# Altium project phonev2.PrjPcb
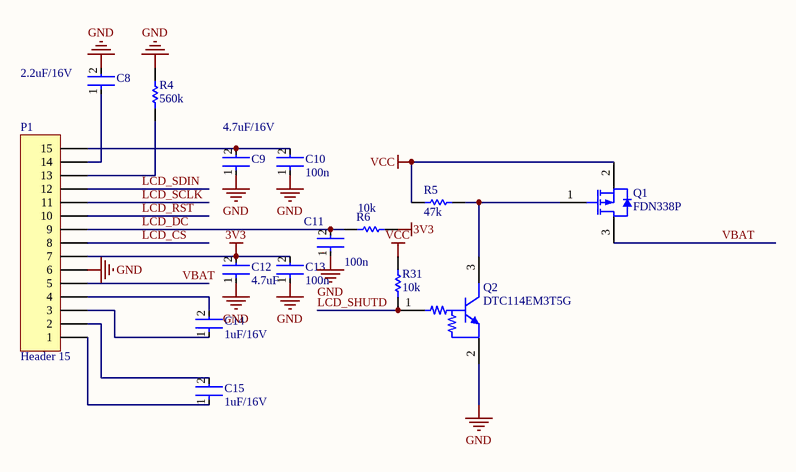
[diagram p0: lcd.SchDoc]
4 sheets, 131 parts. Net scope: global (net labels, ports and power ports of the same name join across sheets).
Board file: PCB.PcbDoc
Sheets:
  lcd.SchDoc
  phone.SchDoc
  keypad.SchDoc
  main.SchDoc

## Sheet lcd.SchDoc
size A

### Parts
C8  2.2uF/16V  [FP-GRM188-0_1-e0_2_0_55-IPC_A]
C9  4.7uF/16V  [FP-GRM188-0_1-e0_2_0_55-IPC_A]
C10  100n  [FP-GRM155-0_05-IPC_A]
C11  100n  [FP-GRM155-0_05-IPC_A]
C12  4.7uF  [FP-GRM188-0_1-e0_2_0_55-IPC_A]
C13  100n  [FP-GRM155-0_05-IPC_A]
C14  1uF/16V  [FP-GRM188-0_1-e0_2_0_55-IPC_A]
C15  1uF/16V  [FP-GRM188-0_1-e0_2_0_55-IPC_A]
P1  Header 15  [FLEX_CONN]
Q1  FDN338P  [FAIR-SSOT3L-3_V]
Q2  DTC114EM3T5G  [ONSC-SOT-723-3-631AA-01_V]
R4  560k  [RESC1005X40X25NL05T10]
R5  47k  [RESC1005X40X25NL05T10]
R6  10k  [RESC1005X40X25NL05T10]
R31  10k  [RESC1005X40X25NL05T10]

### Nets
3V3: C12.2 C13.2 P1.7 R6.1
GND: C8.2 C9.1 C10.1 C11.1 C12.1 C13.1 P1.6 Q2.2(E) R4.2
VCC: Q1.2(SOURCE) R5.1 R31.2
LCD_CS: P1.8
LCD_DC: C11.2 P1.9 R6.2
LCD_RST: P1.10
LCD_SCLK: P1.11
LCD_SDIN: P1.12
LCD_SHUTD: Q2.1(B) R31.1
VBAT: P1.5 Q1.3(DRAIN)
NetC8_1: C8.1 P1.14
NetC9_2: C9.2 C10.2 P1.15
NetC14_1: C14.1 P1.3
NetC14_2: C14.2 P1.4
NetC15_1: C15.1 P1.1
NetC15_2: C15.2 P1.2
NetP1_13: P1.13 R4.1
NetQ1_1: Q1.1(GATE) Q2.3(C) R5.2

### Library data of the parts
C8 C9 C12 C14 C15 = CMP-2006-02792-2: Chip Multilayer Ceramic Capacitors for General Purpose, 0603, 10uF, X5R, 15%, 20%, 6.3V; Packaging: Tape and Reel; Voltage Rating (DC): 6.3V; Width: 0.031inch; Termination: SMD/SMT; Dielectric: X5R; Package Quantity: 4000; Voltage Rating: 6.3V; Capacitance: 10uF; Case/Package: 0603; Min Operating Temperature: -55°C; Voltage: 6.3V; Length: 1.6mm; Thickness: 0.035inch; Lead Free: Lead Free; Depth: 0.8mm; Case Code (Imperial): 0603; Max Operating Temperature: 85°C; Material: Ceramic; Height: 0.8mm; Tolerance: 20%; Mount: Surface Mount; REACH SVHC: No SVHC; Radiation Hardening: No; Case Code (Metric): 1608
C10 C11 C13 = CMP-2008-04369-2: Chip Multilayer Ceramic Capacitors for General Purpose, 0402, 470pF, C0G, 30ppm/°C, 5%, 50V; Insulation Resistance: 10GR; Depth: 0.5mm; Voltage Rating: 50V; Packaging: Tape and Reel; Material: Ceramic; Lead Free: Lead Free; Max Operating Temperature: 125°C; Length: 1mm; Min Operating Temperature: -55°C; Height: 0.5mm; Width: 0.5mm; Thickness: 0.022inch; Voltage: 50V; Termination: SMD/SMT; Dielectric Material: Ceramic; REACH SVHC: No SVHC; Voltage Rating (DC): 50V; Package Quantity: 1; Dielectric: C0G; Radiation Hardening: No; Mount: Surface Mount; Case/Package: 0402; Number of Pins: 2; Tolerance: 5%; Temperature Coefficient: 30ppm/°C; Case Code (Metric): 1005; Capacitance: 470pF; Case Code (Imperial): 0402
P1 = Header 15: Header, 15-Pin; LatestRevisionDate: 17-Jul-2002; LatestRevisionNote: Re-released for DXP Platform.; Publisher: Altium Limited
Q1 = CMP-2000-06251-1: P-Channel Specified Power Trench(R) MOSFET, 2.5 V, -20 V, -1.6 A, -55 to 150 degC, 3-Pin SOT23, RoHS, Tape and Reel; Manufacturer: Fairchild Semiconductor; Current - Continuous Drain (Id) @ 25°C: 1.6A(Ta); Product Training Modules: HighVoltageSwitchesforPowerProcessingSMPSPowerSwitch; Gate Charge (Qg) @ Vgs: 6.2nC@4.5V; Package Version: Rev. 3, 05/2015; PCN Design/Specification: MoldCompound08/April/2008; Vgs(th) (Max) @ Id: 1.5V@250µA; FET Type: MOSFETP-Channel,MetalOxide; FET Feature: Standard; PCN Packaging: BinaryYearCodeMarking15/Jan/2014; Other Names: FDN338PTR; Online Catalog: P-ChannelLogicLevelGateFETs; Input Capacitance (Ciss) @ Vds: 451pF@10V; Rds On (Max) @ Id, Vgs: 115mOhm@1.6A,4.5V; Drain to Source Voltage (Vdss): 20V; Power - Max: 460mW; Datasheet Version: Rev. F1(W), 11/2013; Manufacturer URL: https://www.fairchildsemi.com/; Package Description: 3-Pin Small Outline Transistor, Body 2.92 x 1.4 mm, Pitch 0.95 mm; Datasheet URL: https://datasheet.ciiva.com/22655/1802191-22655335.pdf; Family: FETs-Single; Package URL: https://www.fairchildsemi.com/package-drawings/MA/MA03B.pdf; Package Reference: SSOT3L; Supplier Device Package: 3-SSOT; Standard Package: 3,000; Package / Case: TO-236-3,SC-59,SOT-23-3; Mounting Technology: SurfaceMount; Series: PowerTrench®; Mounting Type: SurfaceMount; Packaging: Tape&Reel(TR); Category: DiscreteSemiconductorProducts
Q2 = CMP-0630-00443-1: Digital Transistor (BRT), R1=10 kOhm, R2=10 kOhm, NPN Transistor, 3-Pin SOT-723, Pb-Free, Tape and Reel; Manufacturer: On Semiconductor; V(BR)CEO Min (V): 50; R1/R2 Typ: 1; IC Continuous (A): 0.1; hFE Min: 35; ComponentLink3Description: Package Specification; Packing: Tape and Reel; ComponentLink1Description: Manufacturer URL; DatasheetVersion: Rev. 5; PackageDescription: 3-Pin Small Outline Transistor, Body 1.2 x 0.8 mm, Pitch 0.4 mm; RoHS: TRUE; Mounting Technology: Surface Mount; ComponentLink2URL: http://www.onsemi.cn/pub_link/Collateral/DTC114E-D.PDF; ComponentLink2Description: Datasheet; ComponentLink1URL: http://www.onsemi.com/; Polarity: NPN; PackageVersion: Rev. D, 08/2009; PartNumber: DTC114EM3T5G; PackageReference: SOT-723-3-631AA-01; ComponentLink3URL: http://www.onsemi.com/pub_link/Collateral/631AA.PDF
R4-R6 R31 = CMP-1011-00001-2: Manufacturer: Yageo / Phycomp; Part Number: RC0402JR-070RL

## Sheet phone.SchDoc
size A4; SheetNumber: 1; SheetTotal: 1
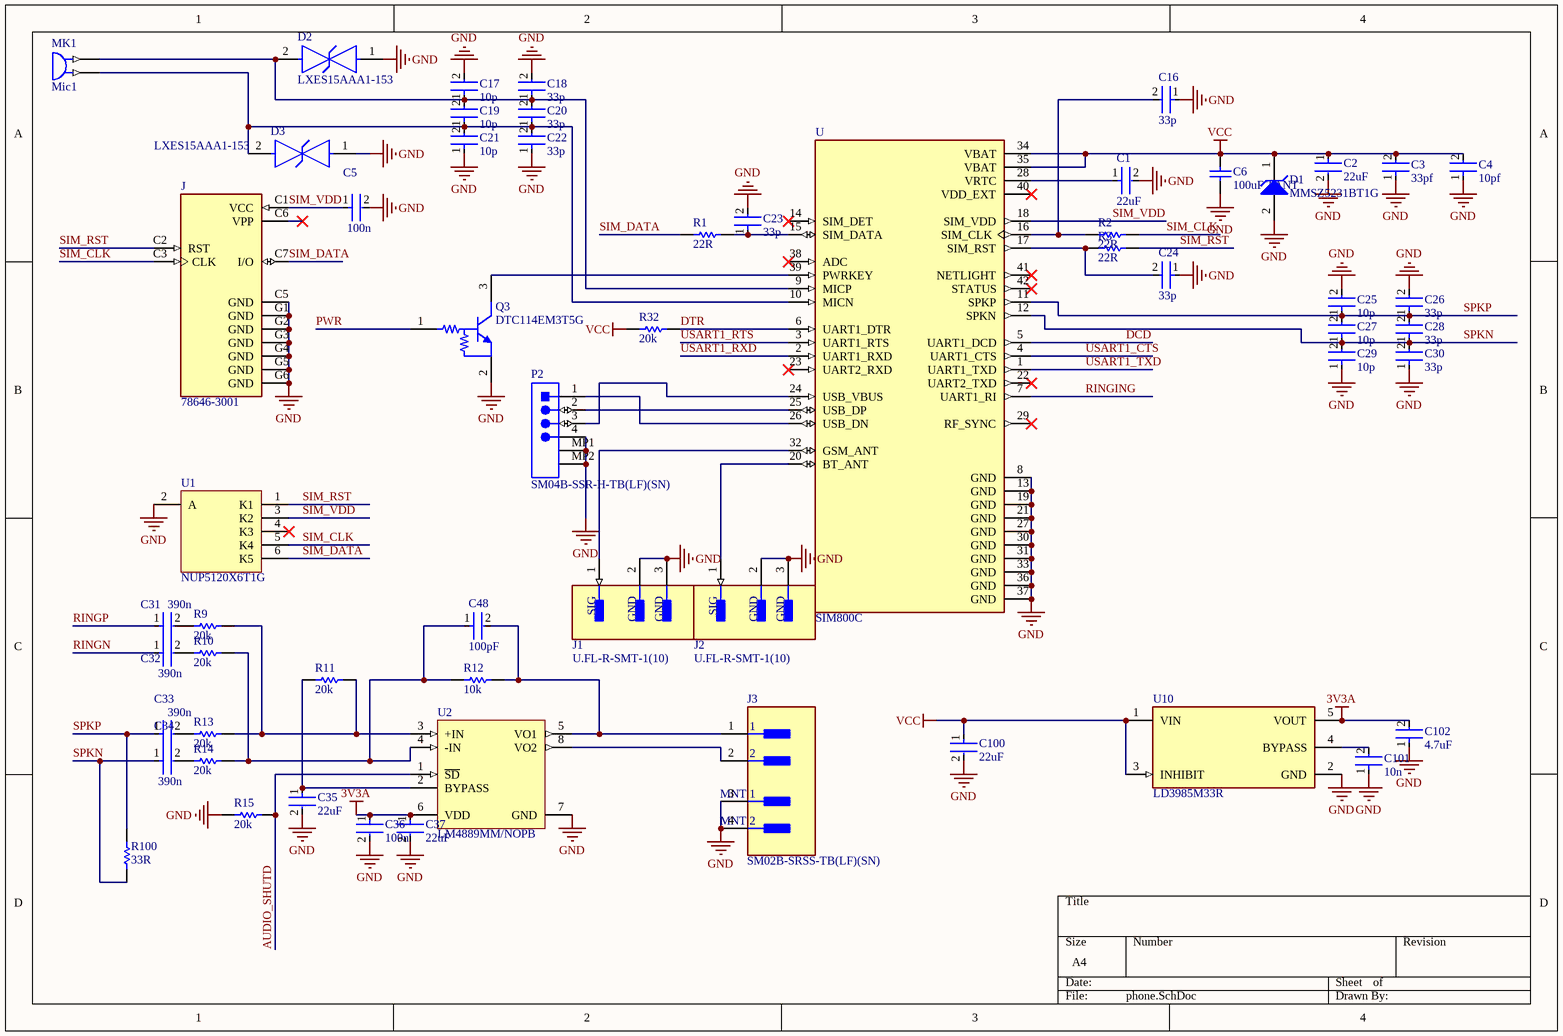
[diagram p1: phone.SchDoc]

### Parts
C1  22uF  [FP-GRM21B-0_15-MFG]
C2  22uF  [FP-GRM21B-0_15-MFG]
C3  33pf  [FP-GRM155-0_05-IPC_A]
C4  10pf  [FP-GRM155-0_05-IPC_A]
C5  100n  [FP-GRM155-0_05-IPC_A]
C6  value 100uF TANT  [CAPMP3525X20N]  (hidden comment: Capacitor)
C16  33p  [FP-GRM155-0_05-IPC_A]
C17  10p  [FP-GRM155-0_05-IPC_A]
C18  33p  [FP-GRM155-0_05-IPC_A]
C19  10p  [FP-GRM155-0_05-IPC_A]
C20  33p  [FP-GRM155-0_05-IPC_A]
C21  10p  [FP-GRM155-0_05-IPC_A]
C22  33p  [FP-GRM155-0_05-IPC_A]
C23  33p  [FP-GRM155-0_05-IPC_A]
C24  33p  [FP-GRM155-0_05-IPC_A]
C25  10p  [FP-GRM155-0_05-IPC_A]
C26  33p  [FP-GRM155-0_05-IPC_A]
C27  10p  [FP-GRM155-0_05-IPC_A]
C28  33p  [FP-GRM155-0_05-IPC_A]
C29  10p  [FP-GRM155-0_05-IPC_A]
C30  33p  [FP-GRM155-0_05-IPC_A]
C31  390n  [FP-GRM155-0_05-IPC_A]
C32  390n  [FP-GRM155-0_05-IPC_A]
C33  390n  [FP-GRM155-0_05-IPC_A]
C34  390n  [FP-GRM155-0_05-IPC_A]
C35  22uF  [FP-GRM21B-0_15-MFG]
C36  100n  [FP-GRM155-0_05-IPC_A]
C37  22uF  [FP-GRM21B-0_15-MFG]
C48  100pF  [FP-GRM155-0_05-IPC_A]
C100  22uF  [FP-GRM21B-0_15-MFG]
C101  10n  [FP-GRM155-0_05-IPC_A]
C102  4.7uF  [FP-GRM188-0_1-e0_2_0_55-IPC_A]
D1  MMSZ5231BT1G  [ONSC-SOD-123-2-425-04_V]
D2  LXES15AAA1-153  [FP-LXES15-MFG]
D3  LXES15AAA1-153  [FP-LXES15-MFG]
J  78646-3001  [MOLEX_78646-3001]
J1  U.FL-R-SMT-1(10)  [FP-U_FL-R-SMT-1_10-MFG]
J2  U.FL-R-SMT-1(10)  [FP-U_FL-R-SMT-1_10-MFG]
J3  SM02B-SRSS-TB(LF)(SN)  [FP-SM02B-SRSS-TB_LF_SN-0]
MK1  Mic1  [4015]
P2  SM04B-SSR-H-TB(LF)(SN)  [JST-SM04B-SSR-H-TB_V]
Q3  DTC114EM3T5G  [ONSC-SOT-723-3-631AA-01_V]
R1  22R  [RESC1005X40X25NL05T10]
R2  22R  [RESC1005X40X25NL05T10]
R3  22R  [RESC1005X40X25NL05T10]
R9  20k  [RESC1005X40X25NL05T10]
R10  20k  [RESC1005X40X25NL05T10]
R11  20k  [RESC1005X40X25NL05T10]
R12  10k  [RESC1005X40X25NL05T10]
R13  20k  [RESC1005X40X25NL05T10]
R14  20k  [RESC1005X40X25NL05T10]
R15  20k  [RESC1005X40X25NL05T10]
R32  20k  [RESC1005X40X25NL05T10]
R100  33R  [RESC1005X40X25NL05T10]
U  SIM800C  [LCC110P1570X1760X250-42N-NEW]
U1  NUP5120X6T1G  [ONSC-SOT-563-6-463A-01_V]
U2  LM4889MM/NOPB  [DGK0008A_L]
U10  LD3985M33R  [FP-SOT23-5L-7049676-MFG]

### Nets
3V3A: C36.1 C37.1 C102.2 U2.6(VDD) U10.5(VOUT)
GND: C1.2 C2.2 C3.1 C4.1 C5.2 C6.2 C16.1 C17.2 C18.2 C21.1 C22.1 C23.2 C24.1 C25.2 C26.2 C29.1 C30.1 C35.2 C36.2 C37.2 C100.2 C101.1 C102.1 D1.2(A) D2.1 D3.1 J.C5(GND) J.G1(GND) J.G2(GND) J.G3(GND) J.G4(GND) J.G5(GND) J.G6(GND) J1.2(GND) J1.3(GND) J2.2(GND) J2.3(GND) J3.3(MNT_1) J3.4(MNT_2) P2.4 P2.MP1 P2.MP2 Q3.2(E) R15.1 U.8(GND) U.13(GND) U.19(GND) U.21(GND) U.27(GND) U.30(GND) U.31(GND) U.33(GND) U.36(GND) U.37(GND) U1.2(A) U2.7(GND) U10.2(GND)
VCC: C2.1 C3.2 C4.2 C6.1 C100.1 D1.1(K) R32.1 U.34(VBAT) U.35(VBAT) U10.1(VIN) U10.3(INHIBIT)
AUDIO_SHUTD: R15.2 U2.1(~{SD})
DCD: U.5(UART1_DCD)
DTR: R32.2 U.6(UART1_DTR)
PWR: Q3.1(B)
RINGING: U.7(UART1_RI)
RINGN: C32.1
RINGP: C31.1
SIM_CLK: J.C3(CLK) R2.2 U1.5(K4)
SIM_DATA: J.C7(I/O) R1.1 U1.6(K5)
SIM_RST: J.C2(RST) R3.2 U1.1(K1)
SIM_VDD: C5.1 J.C1(VCC) U.18(SIM_VDD) U1.3(K2)
SPKN: C27.1 C28.1 C29.2 C30.2 C34.1 R100.1 U.12(SPKN)
SPKP: C25.1 C26.1 C27.2 C28.2 C33.1 R100.2 U.11(SPKP)
USART1_CTS: U.4(UART1_CTS)
USART1_RTS: U.3(UART1_RTS)
USART1_RXD: U.2(UART1_RXD)
USART1_TXD: U.1(UART1_TXD)
NetC1_1: C1.1 U.28(VRTC)
NetC16_2: C16.2 R2.1 U.16(SIM_CLK)
NetC17_1: C17.1 C18.1 C19.2 C20.2 D2.2 MK1.1 U.9(MICP)
NetC19_1: C19.1 C20.1 C21.2 C22.2 D3.2 MK1.2 U.10(MICN)
NetC23_1: C23.1 R1.2 U.15(SIM_DATA)
NetC24_2: C24.2 R3.1 U.17(SIM_RST)
NetC31_2: C31.2 R9.1
NetC32_2: C32.2 R10.1
NetC33_2: C33.2 R13.1
NetC34_2: C34.2 R14.1
NetC35_1: C35.1 R11.1 U2.2(BYPASS)
NetC48_1: C48.1 R10.2 R12.1 R14.2 U2.4(-IN)
NetC48_2: C48.2 J3.1 R12.2 U2.5(VO1)
NetC101_2: C101.2 U10.4(BYPASS)
NetJ1_1: J1.1(SIG) U.32(GSM_ANT)
NetJ2_1: J2.1(SIG) U.20(BT_ANT)
NetJ3_2: J3.2 U2.8(VO2)
NetP2_1: P2.1 U.26(USB_DN)
NetP2_2: P2.2 U.25(USB_DP)
NetP2_3: P2.3 U.24(USB_VBUS)
NetQ3_3: Q3.3(C) U.39(PWRKEY)
NetR9_2: R9.2 R11.2 R13.2 U2.3(+IN)

Not connected (* = marked no-connect by the designer): J C6(VPP)*; U 14(SIM_DET)* 22(UART2_TXD)* 23(UART2_RXD)* 29(RF_SYNC)* 38(ADC)* 40(VDD_EXT)* 41(NETLIGHT)* 42(STATUS)*; U1 4(K3)*

### Library data of the parts
C1 C2 C35 C37 C100 = CMP-2007-03385-2: Chip Multilayer Ceramic Capacitors for General Purpose, 0805, 22uF, X5R, 15%, 20%, 6.3V; Material: Ceramic; Max Operating Temperature: 85°C; Voltage: 6.3V; Min Operating Temperature: -55°C; Case/Package: 0805; Thickness: 0.053inch; Dielectric: X5R; Packaging: Tape and Reel; Depth: 1.25mm; Termination: SMD/SMT; Voltage Rating (DC): 6.3V; Radiation Hardening: No; Tolerance: 20%; Mount: Surface Mount; Lead Free: Lead Free; Package Quantity: 1; REACH SVHC: No SVHC; Voltage Rating: 6.3V; Capacitance: 22uF; Length: 2mm; Case Code (Imperial): 0805; Case Code (Metric): 2012; Width: 0.049inch; Height: 1.25mm
C3-C5 C16-C34 C36 C48 C101 = CMP-2008-04369-2: as C10 on sheet lcd; Depth: 0.5mm; Voltage Rating: 50V; Packaging: Tape and Reel; Material: Ceramic; Lead Free: Lead Free; Max Operating Temperature: 125°C; Length: 1mm; Min Operating Temperature: -55°C; Height: 0.5mm; Width: 0.5mm; Thickness: 0.022inch; Voltage: 50V; Termination: SMD/SMT; Dielectric Material: Ceramic; REACH SVHC: No SVHC; Voltage Rating (DC): 50V; Package Quantity: 1; Dielectric: C0G; Radiation Hardening: No; Mount: Surface Mount; Case/Package: 0402; Number of Pins: 2; Tolerance: 5%; Temperature Coefficient: 30ppm/°C; Case Code (Metric): 1005; Capacitance: 470pF; Case Code (Imperial): 0402
C6 = Capacitor: SimulationGenericComponent: True
C102 = CMP-2006-02792-2: as C8 on sheet lcd; Packaging: Tape and Reel; Voltage Rating (DC): 6.3V; Width: 0.031inch; Termination: SMD/SMT; Dielectric: X5R; Package Quantity: 4000; Voltage Rating: 6.3V; Capacitance: 10uF; Case/Package: 0603; Min Operating Temperature: -55°C; Voltage: 6.3V; Length: 1.6mm; Thickness: 0.035inch; Lead Free: Lead Free; Depth: 0.8mm; Case Code (Imperial): 0603; Max Operating Temperature: 85°C; Material: Ceramic; Height: 0.8mm; Tolerance: 20%; Mount: Surface Mount; REACH SVHC: No SVHC; Radiation Hardening: No; Case Code (Metric): 1608
D1 = CMP-1060-00573-1: Zener Voltage Regulator, 500 mW, 2-Pin SOD-123, Pb-Free, Tape and Reel; Manufacturer: On Semiconductor; P Max (W): 0.5; VZ Typ (V): 5.1; PackageVersion: Rev. G, 10/2009; Mounting Technology: Surface Mount; ComponentLink2Description: Datasheet; ComponentLink3URL: http://www.onsemi.com/pub_link/Collateral/425-04.PDF; PackageDescription: 2-Pin SOD, Body 1.6 x 2.69 mm; Packing: Tape and Reel; ComponentLink2URL: http://www.onsemi.com/pub_link/Collateral/MMSZ5221BT1-D.PDF; ComponentLink1URL: http://www.onsemi.com/; PartNumber: MMSZ5231BT1G; PackageReference: SOD-123-2-425-04; RoHS: Pb-Free; ComponentLink1Description: Manufacturer URL; ComponentLink3Description: Package Specification; DatasheetVersion: Rev. 12
D2 D3 = CMP-06195-000025-1: TVS DIODE 4V 1005; Power Line Protection: No; Number of Bidirectional Channels: 1; Resistor Type: Zener; Case/Package: 0402; Max Operating Temperature: 85°C; Case Code (Metric): 1005; Packaging: Tape and Reel; Min Operating Temperature: -40°C; Mount: Surface Mount; Reverse Standoff Voltage: 4V; Case Code (Imperial): 0402
J = 78646-3001: 6 Position Card Connector Micro SIM Surface Mount, Right Angle Gold; MF: Molex; Price: None; Availability: Unavailable; Package: None; MP: 78646-3001; Value: *; SnapEDA_Link: https://www.snapeda.com/parts/78646-3001/Molex/view-part/75189/?ref=snap
J1 J2 = CMP-2000-05152-3: CONN U.FL RCPT STR 50 OHM SMD; Max Frequency: 6GHz; Connector Type: Coaxial; Body Plating: Silver; Body Material: Bronze; Impedance: 50R; Dielectric Material: Polymer; Insulation Resistance: 500MR; Gender: Male; Packaging: Cut Tape; Length: 3mm; Package Quantity: 2500; Termination: Solder; Lead Free: Lead Free; Series: U.FL; Min Operating Temperature: -40°C; Fastening Type: Snap; Contact Material: Brass; Orientation: Straight; Wire/Cable Type: Coaxial; Frequency: 6GHz; Contact Plating: Gold; Depth: 3.1mm; Weight: 0.001764oz; Max Operating Temperature: 90°C; Radiation Hardening: No; REACH SVHC: No SVHC; Mount: Surface Mount; Housing Color: Beige
J3 = CMP-17439-000024-1: CONN HEADER SMD R/A 2POS 1MM; Current Rating: 700mA; Voltage Rating: 50V; Insulation Resistance: 100MR; Number of Contacts: 2; Contact Resistance: 40mR; Max Current Rating: 1A; Min Operating Temperature: -25°C; Housing Material: Polyamide; Flammability Rating: UL94 V-0; Lead Pitch: 1mm; REACH SVHC: No SVHC; Lead Free: Lead Free; Contact Finish - Mating: TIN; Packaging: Tape and Reel; Series: SR; Length: 4mm; Color: Natural; Housing Color: Beige; Number of Rows: 1; Insulation Color: Natural; Connector Type: Header; Contact Shape: Square; Depth: 4.95mm; Termination: Solder; Voltage Rating (AC): 50V; Max Operating Temperature: 85°C; Pitch: 1mm; Fastening Type: Pull; Number of Positions: 2; Contact Type: Male Pin; Material: Polyamide; Orientation: Right Angle; Mount: Surface Mount; Insulation Material: Nylon; Contact Plating: Copper; Max Voltage Rating (AC): 50V; Contact Material: Copper Alloy
MK1 = Mic1: Microphone; Published: 24-Mar-1999; LatestRevisionDate: 17-Jul-2002; LatestRevisionNote: Re-released for DXP Platform.; PackageReference: PIN2; Publisher: Altium Limited
P2 = CMP-2000-07079-1: SSR Connector, Pitch 1 mm, 1 x 4 Position, Height 2 mm, -20 to 85 degC, RoHS, Tape and Reel; Manufacturer: JST; Style/Orientation: Plug; Pitch: 1mm; No of Positions: 4; Datasheet URL: http://www.jst-mfg.com/product/pdf/eng/eSSR.pdf; Package Reference: SM04B-SSR-H-TB; Type: WiretoBoard; Package Description: SSR Connector, Pitch 1 mm, 1 x 4 Position, Height 2 mm; Datasheet Version: 11/2010; Mounting Technology: SurfaceMount; Termination: IDC; Manufacturer URL: http://www.jst.com/home2.html
Q3 = CMP-0630-00443-1: as Q2 on sheet lcd; ComponentLink3Description: Package Specification; Packing: Tape and Reel; ComponentLink1Description: Manufacturer URL; DatasheetVersion: Rev. 5; PackageDescription: 3-Pin Small Outline Transistor, Body 1.2 x 0.8 mm, Pitch 0.4 mm; RoHS: TRUE; Mounting Technology: Surface Mount; ComponentLink2URL: http://www.onsemi.cn/pub_link/Collateral/DTC114E-D.PDF; ComponentLink2Description: Datasheet; ComponentLink1URL: http://www.onsemi.com/; Polarity: NPN; PackageVersion: Rev. D, 08/2009; PartNumber: DTC114EM3T5G; PackageReference: SOT-723-3-631AA-01; ComponentLink3URL: http://www.onsemi.com/pub_link/Collateral/631AA.PDF
R1-R3 R9-R15 R32 R100 = CMP-1011-00001-2: as R4 on sheet lcd
U = SIM800C: Module: GSM/Bluetooth; GPRS; 2G; 1800MHz, 900MHz; 85.6kbps; SMD; MF: Simcom; MP: SIM800C; Availability: Unavailable; Package: None; Value: *; Price: None; SnapEDA_Link: https://www.snapeda.com/parts/SIM800C/SIMcom%20Wireless%20solutions%20Co.%2CLtd/view-part/571323/?ref=snap
U1 = CMP-1063-00205-1: 5-Line Transient Voltage Suppressor Array, 6-Pin SOT-563, Pb-Free, Tape and Reel; Manufacturer: On Semiconductor; IR Max (uA): 0.5; VRWM Max (V): 5; PPK Max (W): 90; Direction: Unidirectional; V(BR) Min (V): 6.2; C Max (pF): 70; ComponentLink2Description: Datasheet; ComponentLink2URL: http://www.onsemi.com/pub_link/Collateral/NUP5120-D.PDF; ComponentLink3Description: Package Specification; Number of Lines: 5; Packing: Tape and Reel; ComponentLink1Description: Manufacturer URL; PackageDescription: 6-Pin Small Outline Transistor, Body 1.6 x 1.2 mm, Pitch 0.5 mm; ComponentLink1URL: http://www.onsemi.com/; PackageReference: SOT-563-6-463A-01; DatasheetVersion: Rev. 4; ComponentLink3URL: http://www.onsemi.cn/pub_link/Collateral/463A-01.PDF; Mounting Technology: Surface Mount; RoHS: Pb-Free; PartNumber: NUP5120X6T1G; PackageVersion: Rev. F, 04/2005
U2 = CMP-0057-00557-3: 1W Audio Power Amplifier, 8-pin Mini SOIC, Pb-Free; Manufacturer: Texas Instruments; PackageTopMarking: ZXTT*GA2; CompType: Audio IC; PowerWise: N; RoHS: Y; PackageReference: DGK0008A; Code_JEDEC: MO-187-AA; PackageDescription: MINI SOIC, .118 x .118 x .034in, 8 Lead, .0256in Pitch; ComponentLink1URL: http://www.ti.com/general/docs/lit/getliterature.tsp?genericPartNumber=LM4889&fileType=pdf; ComponentLink1Description: Datasheet URL; PinCount: 8
U10 = CMP-0244-00328-2: IC REG LINEAR 3.3V 150MA SOT23-5; Input Bias Current: 85uA; Output Type: Fixed; Max Input Voltage: 6V; Min Input Voltage: 2.5V; Output Voltage Accuracy: 2%; Quiescent Current: 150uA; Number of Regulators: 1; Min Current Limit: 300mA; Dropout Voltage: 60mV; Polarity: Positive; Min Operating Temperature: -40°C; Height: 1.3mm; Radiation Hardening: No; Package Quantity: 1; Number of Pins: 5; Output Current: 150mA; Width: 1.75mm; Length: 3mm; Mount: Surface Mount; Case/Package: SOT-23; Lead Free: Lead Free; Number of Outputs: 1; Max Operating Temperature: 125°C; Accuracy: 2%; Max Output Current: 150mA; Packaging: Tape and Reel; Output Voltage: 3.3V; Min Output Voltage: 3.3V

## Sheet keypad.SchDoc
size A
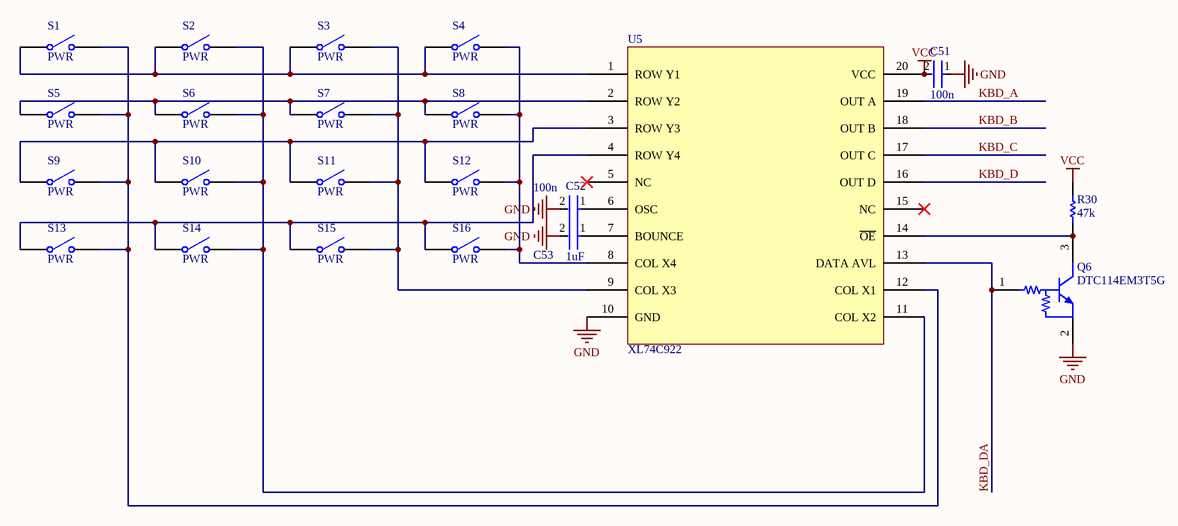
[diagram p2: keypad.SchDoc]

### Parts
C51  100n  [FP-GRM155-0_05-IPC_A]
C52  100n  [FP-GRM188-0_1-e0_2_0_55-IPC_A]
C53  1uF  [FP-GRM188-0_1-e0_2_0_55-IPC_A]
Q6  DTC114EM3T5G  [ONSC-SOT-723-3-631AA-01_V]
R30  47k  [RESC1005X40X25NL05T10]
S1  PWR  [3-6-2.5]
S2  PWR  [3-6-2.5]
S3  PWR  [3-6-2.5]
S4  PWR  [3-6-2.5]
S5  PWR  [3-6-2.5]
S6  PWR  [3-6-2.5]
S7  PWR  [3-6-2.5]
S8  PWR  [3-6-2.5]
S9  PWR  [3-6-2.5]
S10  PWR  [3-6-2.5]
S11  PWR  [3-6-2.5]
S12  PWR  [3-6-2.5]
S13  PWR  [3-6-2.5]
S14  PWR  [3-6-2.5]
S15  PWR  [3-6-2.5]
S16  PWR  [3-6-2.5]
U5  XL74C922  [XL74C922]

### Nets
GND: C51.1 C52.2 C53.2 Q6.2(E) U5.10(GND)
VCC: C51.2 R30.2 U5.20(VCC)
KBD_A: U5.19(OUT_A)
KBD_B: U5.18(OUT_B)
KBD_C: U5.17(OUT_C)
KBD_D: U5.16(OUT_D)
KBD_DA: Q6.1(B) U5.13(DATA_AVL)
NetC52_1: C52.1 U5.6(OSC)
NetC53_1: C53.1 U5.7(BOUNCE)
NetQ6_3: Q6.3(C) R30.1 U5.14(~{OE})
NetS1_1: S1.1(COMMON) S2.1(COMMON) S3.1(COMMON) S4.1(COMMON) U5.1(ROW_Y1)
NetS1_2: S1.2(NO) S5.2(NO) S9.2(NO) S13.2(NO) U5.12(COL_X1)
NetS2_2: S2.2(NO) S6.2(NO) S10.2(NO) S14.2(NO) U5.11(COL_X2)
NetS3_2: S3.2(NO) S7.2(NO) S11.2(NO) S15.2(NO) U5.9(COL_X3)
NetS4_2: S4.2(NO) S8.2(NO) S12.2(NO) S16.2(NO) U5.8(COL_X4)
NetS5_1: S5.1(COMMON) S6.1(COMMON) S7.1(COMMON) S8.1(COMMON) U5.2(ROW_Y2)
NetS9_1: S9.1(COMMON) S10.1(COMMON) S11.1(COMMON) S12.1(COMMON) U5.3(ROW_Y3)
NetS13_1: S13.1(COMMON) S14.1(COMMON) S15.1(COMMON) S16.1(COMMON) U5.4(ROW_Y4)

Not connected (* = marked no-connect by the designer): U5 5(NC)* 15(NC)*

### Library data of the parts
C51 = CMP-2008-04369-2: as C10 on sheet lcd; Depth: 0.5mm; Voltage Rating: 50V; Packaging: Tape and Reel; Material: Ceramic; Lead Free: Lead Free; Max Operating Temperature: 125°C; Length: 1mm; Min Operating Temperature: -55°C; Height: 0.5mm; Width: 0.5mm; Thickness: 0.022inch; Voltage: 50V; Termination: SMD/SMT; Dielectric Material: Ceramic; REACH SVHC: No SVHC; Voltage Rating (DC): 50V; Package Quantity: 1; Dielectric: C0G; Radiation Hardening: No; Mount: Surface Mount; Case/Package: 0402; Number of Pins: 2; Tolerance: 5%; Temperature Coefficient: 30ppm/°C; Case Code (Metric): 1005; Capacitance: 470pF; Case Code (Imperial): 0402
C52 C53 = CMP-2006-02792-2: as C8 on sheet lcd; Packaging: Tape and Reel; Voltage Rating (DC): 6.3V; Width: 0.031inch; Termination: SMD/SMT; Dielectric: X5R; Package Quantity: 4000; Voltage Rating: 6.3V; Capacitance: 10uF; Case/Package: 0603; Min Operating Temperature: -55°C; Voltage: 6.3V; Length: 1.6mm; Thickness: 0.035inch; Lead Free: Lead Free; Depth: 0.8mm; Case Code (Imperial): 0603; Max Operating Temperature: 85°C; Material: Ceramic; Height: 0.8mm; Tolerance: 20%; Mount: Surface Mount; REACH SVHC: No SVHC; Radiation Hardening: No; Case Code (Metric): 1608
Q6 = CMP-0630-00443-1: as Q2 on sheet lcd; ComponentLink3Description: Package Specification; Packing: Tape and Reel; ComponentLink1Description: Manufacturer URL; DatasheetVersion: Rev. 5; PackageDescription: 3-Pin Small Outline Transistor, Body 1.2 x 0.8 mm, Pitch 0.4 mm; RoHS: TRUE; Mounting Technology: Surface Mount; ComponentLink2URL: http://www.onsemi.cn/pub_link/Collateral/DTC114E-D.PDF; ComponentLink2Description: Datasheet; ComponentLink1URL: http://www.onsemi.com/; Polarity: NPN; PackageVersion: Rev. D, 08/2009; PartNumber: DTC114EM3T5G; PackageReference: SOT-723-3-631AA-01; ComponentLink3URL: http://www.onsemi.com/pub_link/Collateral/631AA.PDF
R30 = CMP-1011-00001-2: as R4 on sheet lcd
S1-S16 = SW-SPST: Single-Pole, Single-Throw Switch; Published: 24-Mar-1999; LatestRevisionDate: 17-Jul-2002; LatestRevisionNote: Re-released for DXP Platform.; PackageReference: SPST-2; Publisher: Altium Limited; PackageDescription: Switch; 2 Leads

## Sheet main.SchDoc
size A4; SheetNumber: 1; SheetTotal: 1
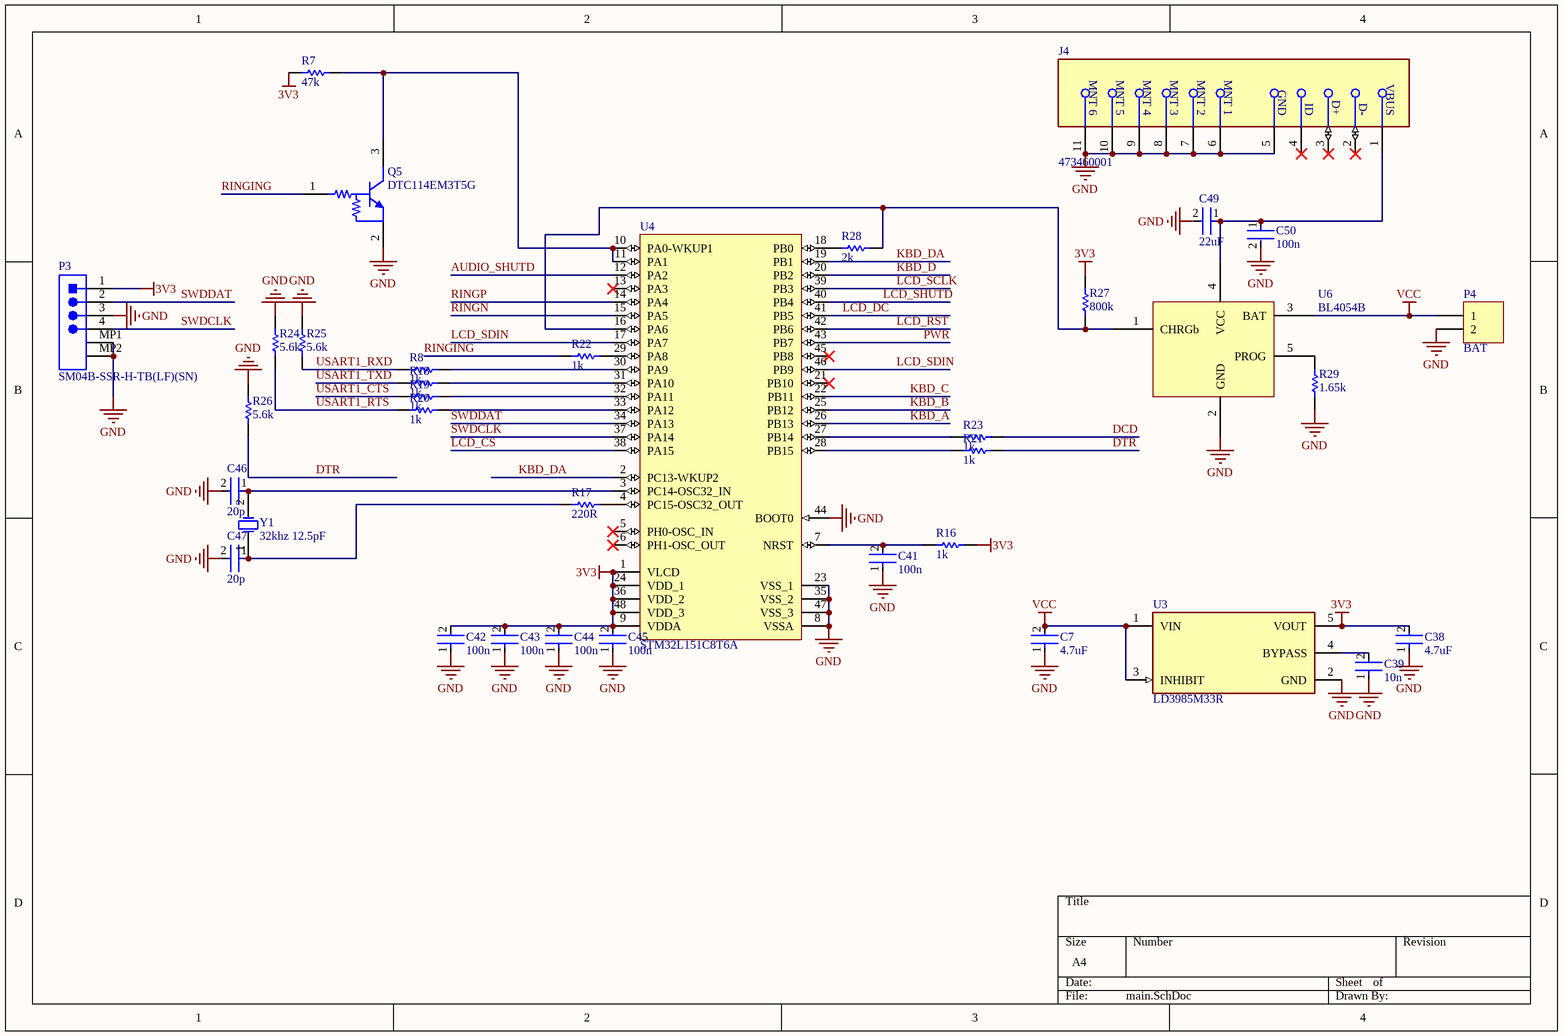
[diagram p3: main.SchDoc]

### Parts
C7  4.7uF  [FP-GRM188-0_1-e0_2_0_55-IPC_A]
C38  4.7uF  [FP-GRM188-0_1-e0_2_0_55-IPC_A]
C39  10n  [FP-GRM155-0_05-IPC_A]
C41  100n  [FP-GRM155-0_05-IPC_A]
C42  100n  [FP-GRM155-0_05-IPC_A]
C43  100n  [FP-GRM155-0_05-IPC_A]
C44  100n  [FP-GRM155-0_05-IPC_A]
C45  100n  [FP-GRM155-0_05-IPC_A]
C46  20p  [FP-GRM155-0_05-IPC_A]
C47  20p  [FP-GRM155-0_05-IPC_A]
C49  22uF  [FP-GRM21B-0_15-MFG]
C50  100n  [FP-GRM155-0_05-IPC_A]
J4  473460001  [FP-473460001-MFG]
P3  SM04B-SSR-H-TB(LF)(SN)  [JST-SM04B-SSR-H-TB_V]
P4  BAT  [HDR1X2]
Q5  DTC114EM3T5G  [ONSC-SOT-723-3-631AA-01_V]
R7  47k  [RESC1005X40X25NL05T10]
R8  1k  [RESC1005X40X25NL05T10]
R16  1k  [RESC1005X40X25NL05T10]
R17  220R  [RESC1005X40X25NL05T10]
R18  1k  [RESC1005X40X25NL05T10]
R19  1k  [RESC1005X40X25NL05T10]
R20  1k  [RESC1005X40X25NL05T10]
R21  1k  [RESC1005X40X25NL05T10]
R22  1k  [RESC1005X40X25NL05T10]
R23  1k  [RESC1005X40X25NL05T10]
R24  5.6k  [RESC1005X40X25NL05T10]
R25  5.6k  [RESC1005X40X25NL05T10]
R26  5.6k  [RESC1005X40X25NL05T10]
R27  800k  [RESC1005X40X25NL05T10]
R28  2k  [RESC1005X40X25NL05T10]
R29  1.65k  [RESC1005X40X25NL05T10]
U3  LD3985M33R  [FP-SOT23-5L-7049676-MFG]
U4  STM32L151C8T6A  [STM-LQFP48_M]
U6  BL4054B  [BL4054B]
Y1  32khz 12.5pF  [YT-26]

### Nets
3V3: C38.2 C42.2 C43.2 C44.2 C45.2 P3.1 R7.2 R16.1 R27.2 U3.5(VOUT) U4.1(VLCD) U4.9(VDDA) U4.24(VDD_1) U4.36(VDD_2) U4.48(VDD_3)
GND: C7.1 C38.1 C39.1 C41.1 C42.1 C43.1 C44.1 C45.1 C46.2 C47.2 C49.2 C50.2 J4.5(GND) J4.6(MNT_1) J4.7(MNT_2) J4.8(MNT_3) J4.9(MNT_4) J4.10(MNT_5) J4.11(MNT_6) P3.3 P3.MP1 P3.MP2 P4.2 Q5.2(E) R24.2 R25.2 R26.2 R29.2 U3.2(GND) U4.8(VSSA) U4.23(VSS_1) U4.35(VSS_2) U4.44(BOOT0) U4.47(VSS_3) U6.2(GND)
VCC: C7.2 P4.1 U3.1(VIN) U3.3(INHIBIT) U6.3(BAT)
AUDIO_SHUTD: U4.12(PA2)
DCD: R23.1
DTR: R21.2 R26.1
KBD_A: U4.26(PB13)
KBD_B: U4.25(PB12)
KBD_C: U4.22(PB11)
KBD_D: U4.20(PB2)
KBD_DA: U4.2(PC13-WKUP2) U4.19(PB1)
LCD_CS: U4.38(PA15)
LCD_DC: U4.41(PB5)
LCD_RST: U4.42(PB6)
LCD_SCLK: U4.39(PB3)
LCD_SDIN: U4.17(PA7) U4.46(PB9)
LCD_SHUTD: U4.40(PB4)
PWR: U4.43(PB7)
RINGING: Q5.1(B) R22.2
RINGN: U4.15(PA5)
RINGP: U4.14(PA4)
SWDCLK: P3.4 U4.37(PA14)
SWDDAT: P3.2 U4.34(PA13)
USART1_CTS: R19.1
USART1_RTS: R20.1 R24.1
USART1_RXD: R8.1 R25.1
USART1_TXD: R18.1
NetC39_2: C39.2 U3.4(BYPASS)
NetC41_2: C41.2 R16.2 U4.7(NRST)
NetC46_1: C46.1 U4.3(PC14-OSC32_IN) Y1.2(OSC2)
NetC47_1: C47.1 R17.1 Y1.1(OSC1)
NetC49_1: C49.1 C50.1 J4.1(VBUS) U6.4(VCC)
NetQ5_3: Q5.3(C) R7.1 U4.10(PA0-WKUP1) U4.11(PA1)
NetR8_2: R8.2 U4.30(PA9)
NetR17_2: R17.2 U4.4(PC15-OSC32_OUT)
NetR18_2: R18.2 U4.31(PA10)
NetR19_2: R19.2 U4.32(PA11)
NetR20_2: R20.2 U4.33(PA12)
NetR21_1: R21.1 U4.28(PB15)
NetR22_1: R22.1 U4.29(PA8)
NetR23_2: R23.2 U4.27(PB14)
NetR27_1: R27.1 R28.1 U4.16(PA6) U6.1(CHRGb)
NetR28_2: R28.2 U4.18(PB0)
NetR29_1: R29.1 U6.5(PROG)

Not connected (* = marked no-connect by the designer): J4 2(D-)* 3(D+)* 4(ID)*; U4 5(PH0-OSC_IN)* 6(PH1-OSC_OUT)* 13(PA3)* 21(PB10)* 45(PB8)*

### Library data of the parts
C7 C38 = CMP-2006-02792-2: as C8 on sheet lcd; Packaging: Tape and Reel; Voltage Rating (DC): 6.3V; Width: 0.031inch; Termination: SMD/SMT; Dielectric: X5R; Package Quantity: 4000; Voltage Rating: 6.3V; Capacitance: 10uF; Case/Package: 0603; Min Operating Temperature: -55°C; Voltage: 6.3V; Length: 1.6mm; Thickness: 0.035inch; Lead Free: Lead Free; Depth: 0.8mm; Case Code (Imperial): 0603; Max Operating Temperature: 85°C; Material: Ceramic; Height: 0.8mm; Tolerance: 20%; Mount: Surface Mount; REACH SVHC: No SVHC; Radiation Hardening: No; Case Code (Metric): 1608
C39 C41-C47 C50 = CMP-2008-04369-2: as C10 on sheet lcd; Depth: 0.5mm; Voltage Rating: 50V; Packaging: Tape and Reel; Material: Ceramic; Lead Free: Lead Free; Max Operating Temperature: 125°C; Length: 1mm; Min Operating Temperature: -55°C; Height: 0.5mm; Width: 0.5mm; Thickness: 0.022inch; Voltage: 50V; Termination: SMD/SMT; Dielectric Material: Ceramic; REACH SVHC: No SVHC; Voltage Rating (DC): 50V; Package Quantity: 1; Dielectric: C0G; Radiation Hardening: No; Mount: Surface Mount; Case/Package: 0402; Number of Pins: 2; Tolerance: 5%; Temperature Coefficient: 30ppm/°C; Case Code (Metric): 1005; Capacitance: 470pF; Case Code (Imperial): 0402
C49 = CMP-2007-03385-2: as C1 on sheet phone; Material: Ceramic; Max Operating Temperature: 85°C; Voltage: 6.3V; Min Operating Temperature: -55°C; Case/Package: 0805; Thickness: 0.053inch; Dielectric: X5R; Packaging: Tape and Reel; Depth: 1.25mm; Termination: SMD/SMT; Voltage Rating (DC): 6.3V; Radiation Hardening: No; Tolerance: 20%; Mount: Surface Mount; Lead Free: Lead Free; Package Quantity: 1; REACH SVHC: No SVHC; Voltage Rating: 6.3V; Capacitance: 22uF; Length: 2mm; Case Code (Imperial): 0805; Case Code (Metric): 2012; Width: 0.049inch; Height: 1.25mm
J4 = CMP-2000-05246-2: CONN RCPT USB2.0 MICRO B SMD R/A; Manufacturer: Molex; Conn Orientation: Right Angle; Is Female: yes; Shielding: true; Pitch: 0.65mm; Number Of Contacts: 5; Voltage Rating: 30V; Current Rating: 1.8A; Device Class L2: USB Connectors; Digikey Description: CONN RCPT USB2.0 MICRO B SMD R/A; Height: 2.945mm; RoHS: TRUE; ComponentLink2Description: Datasheet; Octopart: https://octopart.com/47346-0001-molex-7164928; Automotive: No; Package: 0; Category: Conn; Device Class L1: Connectors; Usb Standard: USB 2.0; Temperature: -30°C to +85°C; Temperature Range Low: -30°C; Footprint Url: https://www.molex.com/pdm_docs/sd/473460001_sd.pdf; ComponentLink2URL: https://www.molex.com/webdocs/datasheets/pdf/en-us/0473460001_IO_CONNECTORS.pdf; Lead Free: Yes; Manufacturer Part Number: 473460001; Contact Material: Gold,Nickel; Temperature Range High: +85°C; Device Class L3: unset
P3 = CMP-2000-07079-1: as P2 on sheet phone; Datasheet URL: http://www.jst-mfg.com/product/pdf/eng/eSSR.pdf; Package Reference: SM04B-SSR-H-TB; Type: WiretoBoard; Package Description: SSR Connector, Pitch 1 mm, 1 x 4 Position, Height 2 mm; Datasheet Version: 11/2010; Mounting Technology: SurfaceMount; Termination: IDC; Manufacturer URL: http://www.jst.com/home2.html
P4 = Header 2: Header, 2-Pin; LatestRevisionDate: 17-Jul-2002; LatestRevisionNote: Re-released for DXP Platform.; Publisher: Altium Limited
Q5 = CMP-0630-00443-1: as Q2 on sheet lcd; ComponentLink3Description: Package Specification; Packing: Tape and Reel; ComponentLink1Description: Manufacturer URL; DatasheetVersion: Rev. 5; PackageDescription: 3-Pin Small Outline Transistor, Body 1.2 x 0.8 mm, Pitch 0.4 mm; RoHS: TRUE; Mounting Technology: Surface Mount; ComponentLink2URL: http://www.onsemi.cn/pub_link/Collateral/DTC114E-D.PDF; ComponentLink2Description: Datasheet; ComponentLink1URL: http://www.onsemi.com/; Polarity: NPN; PackageVersion: Rev. D, 08/2009; PartNumber: DTC114EM3T5G; PackageReference: SOT-723-3-631AA-01; ComponentLink3URL: http://www.onsemi.com/pub_link/Collateral/631AA.PDF
R7 R8 R16-R29 = CMP-1011-00001-2: as R4 on sheet lcd
U3 = CMP-0244-00328-2: as U10 on sheet phone; Min Operating Temperature: -40°C; Height: 1.3mm; Radiation Hardening: No; Package Quantity: 1; Number of Pins: 5; Output Current: 150mA; Width: 1.75mm; Length: 3mm; Mount: Surface Mount; Case/Package: SOT-23; Lead Free: Lead Free; Number of Outputs: 1; Max Operating Temperature: 125°C; Accuracy: 2%; Max Output Current: 150mA; Packaging: Tape and Reel; Output Voltage: 3.3V; Min Output Voltage: 3.3V
U4 = CMP-0236-00182-2: ARM Cortex-M3 32-bit MCU, 64 KB Flash, 32 KB Internal RAM, 37 I/Os, 48-Pin LQFP, -40 to 85 degC, Tray; Manufacturer: STMicroelectronics; FLASH Size (Prog) (kB): 64; Internal RAM Size (kB): 32; Supply Voltage(Vcc) min (V): 1.8; Data E2PROM nom (B): 4096; I/Os (High Current): 37; D/A Converter: 2; ComponentLink2Description: Datasheet; Package Description: 48-Pin Low Profile Quad Flat Package, Body 7 x 7 mm, Pitch 0.5 mm; Mounting Technology: Surface Mount; Package Reference: LQFP48; ComponentLink1Description: Manufacturer URL; Operating Frequency(F) (Processor speed) (MHz): 32; ComponentLink2URL: http://www.st.com/st-web-ui/static/active/en/resource/technical/document/datasheet/DM00078689.pdf; ComponentLink1URL: http://www.st.com/; PartNumber: STM32L151C8T6A; Core: ARM Cortex-M3; DatasheetVersion: Rev. 4; Packing: Tray
U6 = Component_1
Y1 = XTAL: Crystal Oscillator; Published: 8-Jun-2000; LatestRevisionDate: 17-Jul-2002; LatestRevisionNote: Re-released for DXP Platform.; PackageReference: R38; Publisher: Altium Limited; PackageDescription: Crystal, Thru-Hole; 2 Leads; Body 3.1 x 8.2 mm (Dia.xH)

## Nets that join several sheets
3V3: lcd (C12.2 C13.2 P1.7 R6.1), main (15 pins)
GND: lcd (9 pins), phone (57 pins), keypad (5 pins), main (35 pins)
VCC: lcd (Q1.2 R5.1 R31.2), phone (11 pins), keypad (C51.2 R30.2 U5.20), main (5 pins)
AUDIO_SHUTD: phone (R15.2 U2.1), main (U4.12)
DCD: phone (U.5), main (R23.1)
DTR: phone (R32.2 U.6), main (R21.2 R26.1)
KBD_A: keypad (U5.19), main (U4.26)
KBD_B: keypad (U5.18), main (U4.25)
KBD_C: keypad (U5.17), main (U4.22)
KBD_D: keypad (U5.16), main (U4.20)
KBD_DA: keypad (Q6.1 U5.13), main (U4.2 U4.19)
LCD_CS: lcd (P1.8), main (U4.38)
LCD_DC: lcd (C11.2 P1.9 R6.2), main (U4.41)
LCD_RST: lcd (P1.10), main (U4.42)
LCD_SCLK: lcd (P1.11), main (U4.39)
LCD_SDIN: lcd (P1.12), main (U4.17 U4.46)
LCD_SHUTD: lcd (Q2.1 R31.1), main (U4.40)
PWR: phone (Q3.1), main (U4.43)
RINGING: phone (U.7), main (Q5.1 R22.2)
RINGN: phone (C32.1), main (U4.15)
RINGP: phone (C31.1), main (U4.14)
USART1_CTS: phone (U.4), main (R19.1)
USART1_RTS: phone (U.3), main (R20.1 R24.1)
USART1_RXD: phone (U.2), main (R8.1 R25.1)
USART1_TXD: phone (U.1), main (R18.1)